# EAGLE design LED (EAGLE 9.6.2)
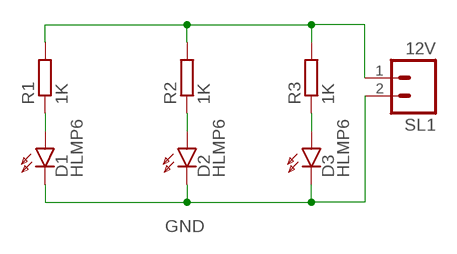
[diagram p0: schematic, sheet 1]

## Parts
D1  HLMP6  [HLMP6]
D2  HLMP6  [HLMP6]
D3  HLMP6  [HLMP6]
R1  1K  R-EU_0204/7  [0204/7]
R2  1K  R-EU_0204/7  [0204/7]
R3  1K  R-EU_0204/7  [0204/7]
SL1  12V  M02  [02P]

## Nets
GND: D1.K D2.K D3.K SL1.2
N$1: D1.A R1.1
N$2: D2.A R2.1
N$3: D3.A R3.1
N$5: R1.2 R2.2 R3.2 SL1.1

## Library data of the parts
D1-D3 = display-hp:HLMP6: LED 2mm horizontal; MF: AGILENT TECHNOLOGIES; MPN: HLMP-6500; OC_FARNELL: 1652490; OC_NEWARK: 40K0088
R1-R3 = rcl:R-EU_: RESISTOR, European symbol; SPICEPREFIX: R
SL1 = con-amp-quick:M02: AMP QUICK CONNECTOR; OC_FARNELL: unknown; OC_NEWARK: unknown

## Board
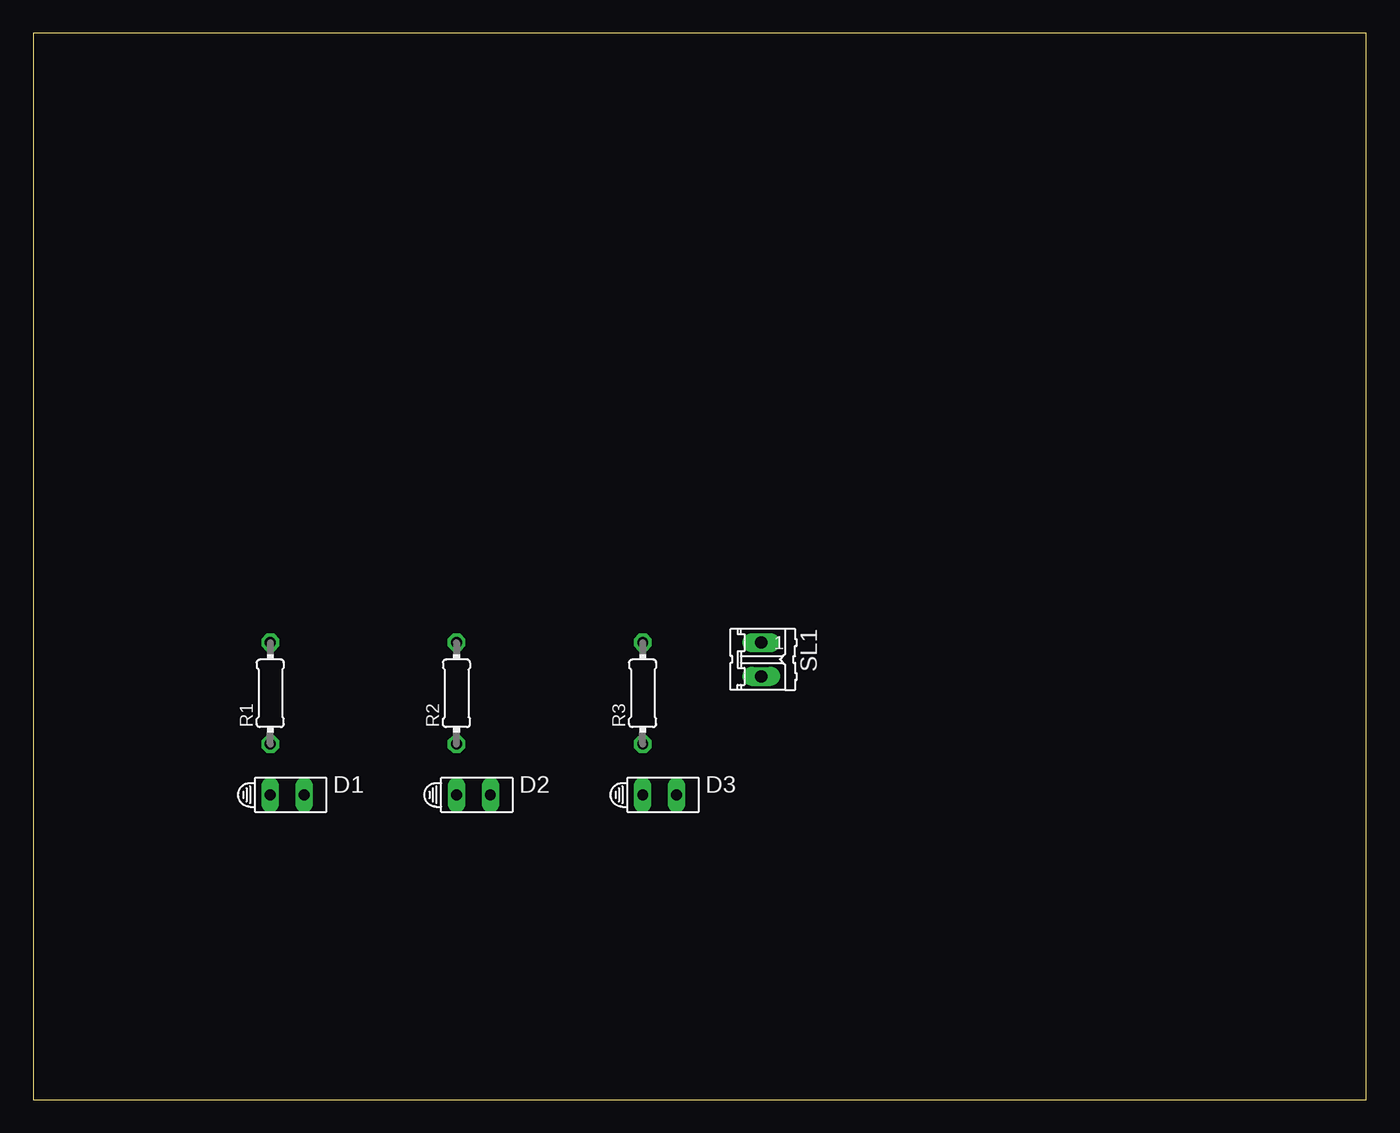
[diagram p1: board, top side]
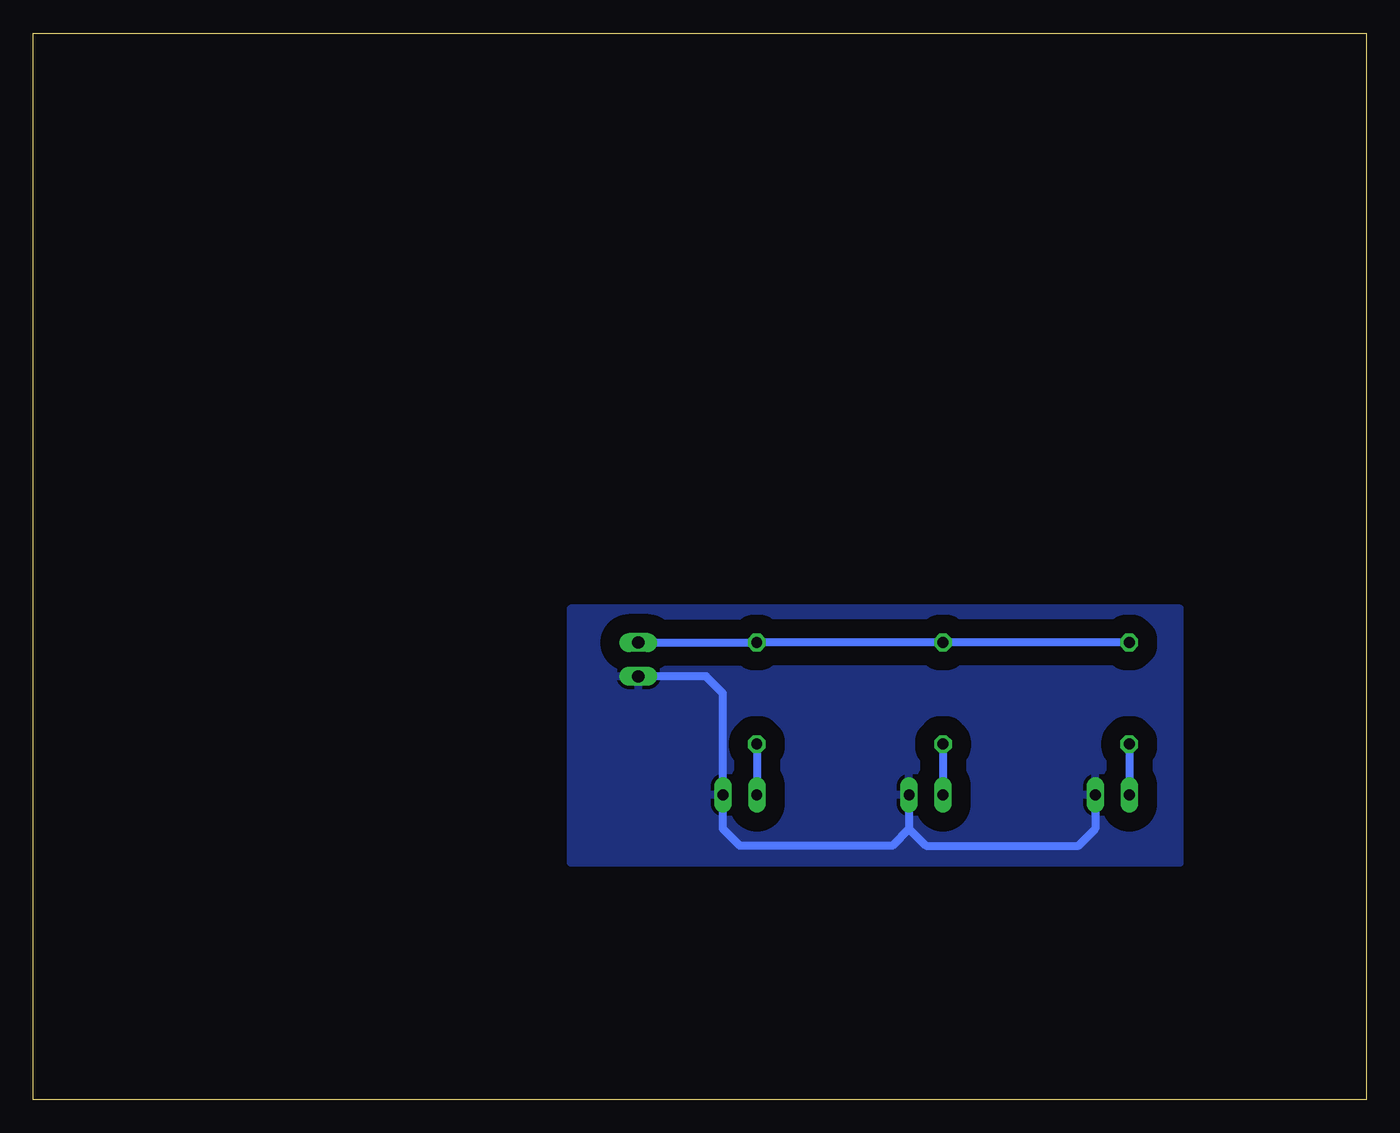
[diagram p2: board, bottom side, seen from below]

Size 100 x 80 mm. Coordinates in mm from the lower left corner, seen from the top.
Outline: 0,0 100,0 100,80 0,80 0,0
Copper layers (1*16): Top 0.035mm / dielectric 1.5mm / Bottom 0.035mm
Design rules "default": minimum track width 6mil, minimum drill 0.35mm, track to track 6mil, track to pad 6mil, pad to pad 6mil, via to via 6mil, smd to smd 6mil, copper to edge 40mil, drill to drill 6mil, minimum pad ring 10mil, minimum via ring 8mil, stop-mask expansion 4mil, vias tented up to drill 0mil, thermal gap 10mil

### Footprints (pad centres in the part's own frame; a part is rotated, then mirrored left to right if it is on the bottom)
HLMP6 = drill 0.813 long: A -1.27,0; K 1.27,0
0204/7 = drill 0.813 octagon: 1 -3.81,0; 2 3.81,0
02P = drill 0.914 long: 1 -1.27,0; 2 1.27,0

### Placement (x,y rotation side)
D1  19.05,22.86 0 top
D2  33.02,22.86 0 top
D3  46.99,22.86 0 top
R1  17.78,30.48 90 top
R2  31.75,30.48 90 top
R3  45.72,30.48 90 top
SL1  54.61,33.02 270 top

### Tracks (layer width: path | path; a pad name or v marks a point on that pad's centre or on a via)
GND
  Bottom 0.61: 48.26,21.59 D3.K | D1.K 20.32,20.32 21.59,19.05 33.02,19.05 34.29,20.32 | 53.34,31.75 SL1.2 49.53,31.75 48.26,30.48 D3.K | D2.K 34.29,20.32 | 34.29,20.32 35.56,19.05 46.99,19.05 48.26,20.32 D3.K
  pour Bottom (isolate 1.422): 13.97,36.83 59.69,36.83 59.69,17.78 13.97,17.78
N$1
  Bottom 0.61: R1.1 D1.A
N$2
  Bottom 0.61: R2.1 D2.A
N$3
  Bottom 0.61: R3.1 D3.A
N$5
  Bottom 0.61: R1.2 R2.2 R3.2 SL1.1